# EasyEDA Pro project ProPrj_Inverted_MAML_6x6_2026-08-30.epro, schematic SUM35
Create Date: 2026-06-14; Page Name: P1; Project Name: Inverted_MAML_6x6; Schematic Name: Schematic1; Update Date: 2026-06-14; Company: EasyEDA.com; Drawn: Olle Welin; Page Size: A4; Version: V1.0
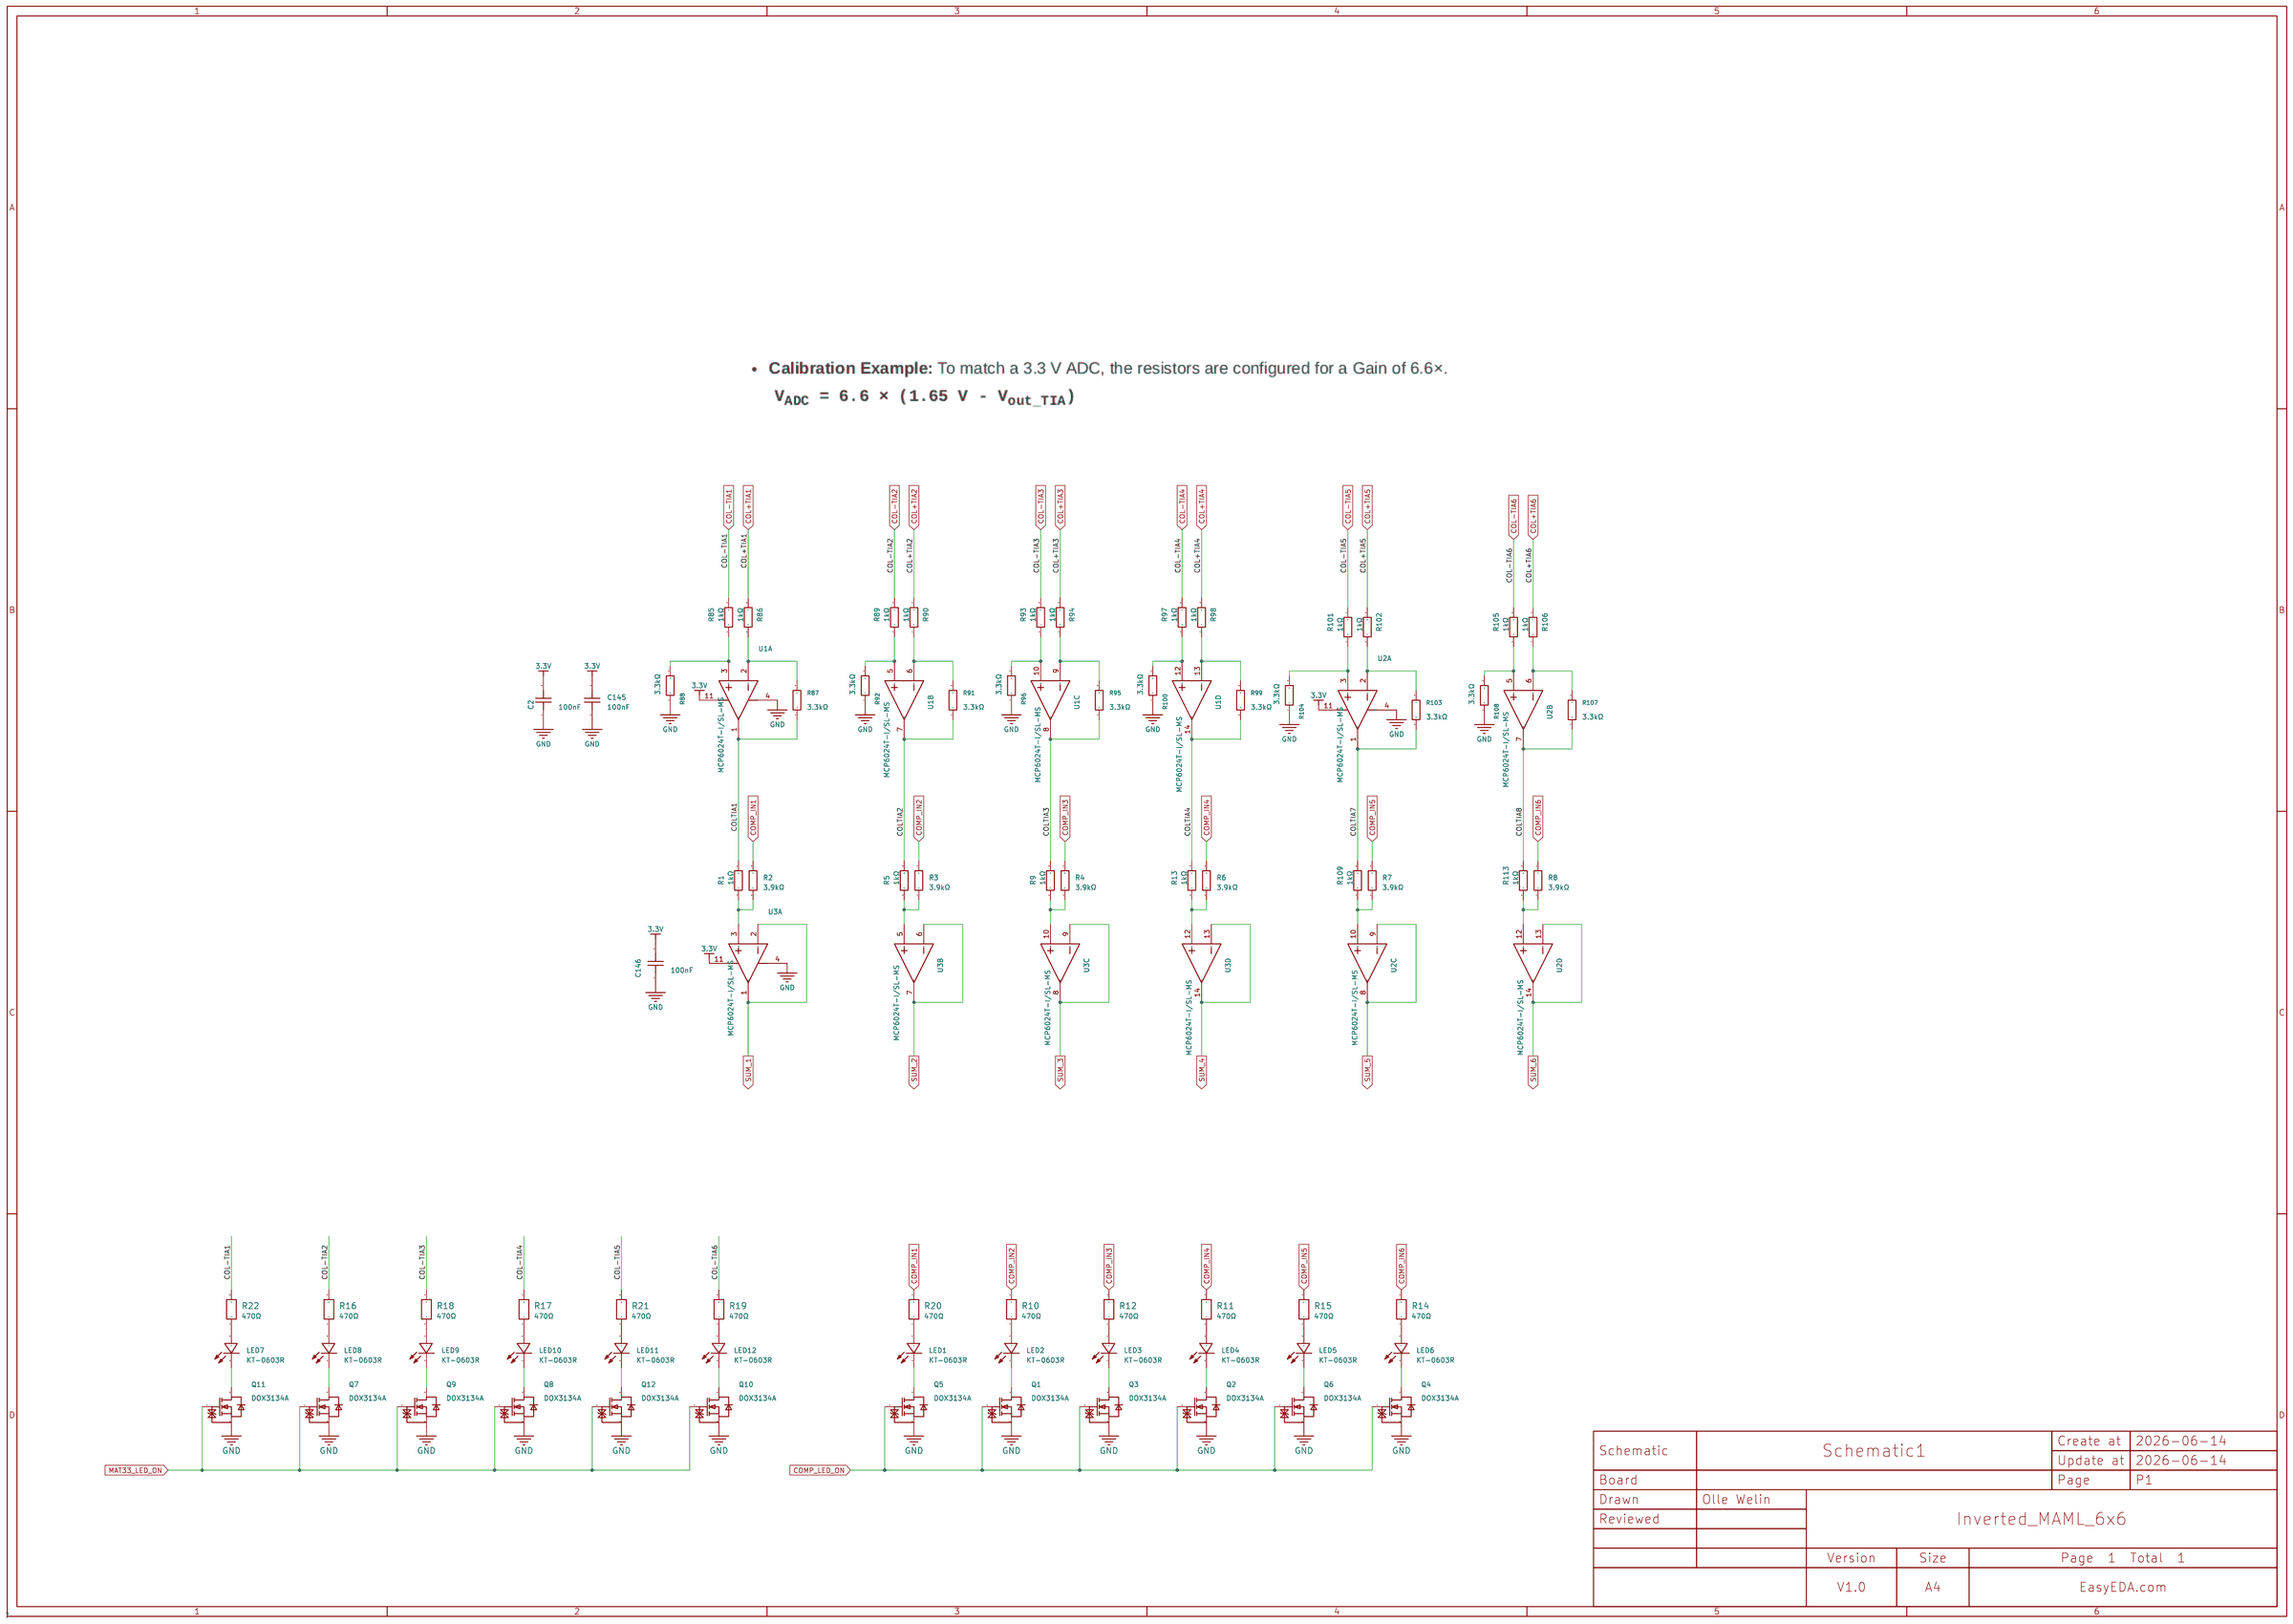
[diagram p6: schematic sheet]

## Parts
C2  100nF  [C0402]
C145  100nF  [C0402]
C146  100nF  [C0402]
LED1  KT-0603R  [LED0603-RD]
LED2  KT-0603R  [LED0603-RD]
LED3  KT-0603R  [LED0603-RD]
LED4  KT-0603R  [LED0603-RD]
LED5  KT-0603R  [LED0603-RD]
LED6  KT-0603R  [LED0603-RD]
LED7  KT-0603R  [LED0603-RD]
LED8  KT-0603R  [LED0603-RD]
LED9  KT-0603R  [LED0603-RD]
LED10  KT-0603R  [LED0603-RD]
LED11  KT-0603R  [LED0603-RD]
LED12  KT-0603R  [LED0603-RD]
Q1  DOX3134A  [SOT-323-3_L2.1-W1.3-P1.30-LS2.3-BR]
Q2  DOX3134A  [SOT-323-3_L2.1-W1.3-P1.30-LS2.3-BR]
Q3  DOX3134A  [SOT-323-3_L2.1-W1.3-P1.30-LS2.3-BR]
Q4  DOX3134A  [SOT-323-3_L2.1-W1.3-P1.30-LS2.3-BR]
Q5  DOX3134A  [SOT-323-3_L2.1-W1.3-P1.30-LS2.3-BR]
Q6  DOX3134A  [SOT-323-3_L2.1-W1.3-P1.30-LS2.3-BR]
Q7  DOX3134A  [SOT-323-3_L2.1-W1.3-P1.30-LS2.3-BR]
Q8  DOX3134A  [SOT-323-3_L2.1-W1.3-P1.30-LS2.3-BR]
Q9  DOX3134A  [SOT-323-3_L2.1-W1.3-P1.30-LS2.3-BR]
Q10  DOX3134A  [SOT-323-3_L2.1-W1.3-P1.30-LS2.3-BR]
Q11  DOX3134A  [SOT-323-3_L2.1-W1.3-P1.30-LS2.3-BR]
Q12  DOX3134A  [SOT-323-3_L2.1-W1.3-P1.30-LS2.3-BR]
R1  1kΩ  [R0402]
R2  3.9kΩ  [R0402]
R3  3.9kΩ  [R0402]
R4  3.9kΩ  [R0402]
R5  1kΩ  [R0402]
R6  3.9kΩ  [R0402]
R7  3.9kΩ  [R0402]
R8  3.9kΩ  [R0402]
R9  1kΩ  [R0402]
R10  470Ω  [R0402]
R11  470Ω  [R0402]
R12  470Ω  [R0402]
R13  1kΩ  [R0402]
R14  470Ω  [R0402]
R15  470Ω  [R0402]
R16  470Ω  [R0402]
R17  470Ω  [R0402]
R18  470Ω  [R0402]
R19  470Ω  [R0402]
R20  470Ω  [R0402]
R21  470Ω  [R0402]
R22  470Ω  [R0402]
R85  1kΩ  [R0402]
R86  1kΩ  [R0402]
R87  3.3kΩ  [R0402]
R88  3.3kΩ  [R0402]
R89  1kΩ  [R0402]
R90  1kΩ  [R0402]
R91  3.3kΩ  [R0402]
R92  3.3kΩ  [R0402]
R93  1kΩ  [R0402]
R94  1kΩ  [R0402]
R95  3.3kΩ  [R0402]
R96  3.3kΩ  [R0402]
R97  1kΩ  [R0402]
R98  1kΩ  [R0402]
R99  3.3kΩ  [R0402]
R100  3.3kΩ  [R0402]
R101  1kΩ  [R0402]
R102  1kΩ  [R0402]
R103  3.3kΩ  [R0402]
R104  3.3kΩ  [R0402]
R105  1kΩ  [R0402]
R106  1kΩ  [R0402]
R107  3.3kΩ  [R0402]
R108  3.3kΩ  [R0402]
R109  1kΩ  [R0402]
R113  1kΩ  [R0402]
U1  MCP6024T-I/SL-MS  [SOIC-14_L8.7-W3.9-P1.27-LS6.0-BL-1]  (sections 1,2,3,4)
U2  MCP6024T-I/SL-MS  [SOIC-14_L8.7-W3.9-P1.27-LS6.0-BL-1]  (sections 1,2,3,4)
U3  MCP6024T-I/SL-MS  [SOIC-14_L8.7-W3.9-P1.27-LS6.0-BL-1]  (sections 1,2,3,4)

## Library data of the parts
C2 C145 C146 = CL05B104KO5NNNC: Capacitance:100nF Tolerance:±10% Tolerance:±10% Voltage Rating:16V Temperature Coefficient:X7R; LCSC Part Name: 100nF ±10% 16V; Supplier Part: C1525; Manufacturer: SAMSUNG(三星); Supplier Footprint: 0402; JLCPCB Part Class: Basic Part; Datasheet: https://item.szlcsc.com/datasheet/CL05B104KO5NNNC/1877.html; Supplier: LCSC; Tolerance: ±10%; Voltage Rating: 16V; Temperature Coefficient: X7R
LED1-LED12 = KT-0603R: Emitted Color:Red Power Dissipation:- Forward Current:- Dominant Wavelength:- Dominant Wavelength:- Peak Wavelength:- Diode Configuration:- Lens Color:- Color Temperature:- Color Temperature:- Viewing Angle:- Mounting Sytle:- Operating Temperature:-40℃~+8; LCSC Part Name: 0603 红灯 高亮; Supplier Part: C2286; Manufacturer: KENTO; Supplier Footprint: 0603; JLCPCB Part Class: Basic Part; Datasheet: https://atta.szlcsc.com/upload/public/pdf/source/20160616/1466072038404.pdf; Supplier: LCSC; Emitted Color: Red; Operating Temperature: -40℃~+85℃
Q1-Q12 = DOX3134A: Number:1 N-channel Drain to Source Voltage:20V Current - Continuous Drain(Id):900mA RDS(on):120Ω@4.5V Pd - Power Dissipation:220mW Gate Threshold Voltage (Vgs(th)):600mV Gate Charge(Qg):1nC@4.5V Input Capacitance(Ciss):63pF Reverse Transfer Capacitance (C; Supplier Part: C54349756; Manufacturer: DOINGTER(杜因特); Supplier Footprint: SOT-323; JLCPCB Part Class: Extended Part; Datasheet: https://item.szlcsc.com/datasheet/DOX3134A/57652932.html; Supplier: LCSC; Number: 1 N-channel; Drain to Source Voltage: 20V; Current - Continuous Drain(Id): 900mA; RDS(on): 120Ω@4.5V; Pd - Power Dissipation: 220mW; Gate Threshold Voltage (Vgs(th)): 600mV; Gate Charge(Qg): 1nC@4.5V; Input Capacitance(Ciss): 63pF; Reverse Transfer Capacitance (Crss@Vds): 12pF; Operating Temperature: -50℃~+150℃; Type: N-Channel; Output Capacitance(Coss): 23pF
R1 R5 R9 R13 R85 R86 R89 R90 R93 R94 R97 R98 R101 R102 R105 R106 R109 R113 = 0402WGF1001TCE: Type:Thick Film Resistor Resistance:1kΩ Tolerance:±1% Tolerance:±1% Power(Watts):62.5mW Voltage-Supply(Max):50V Temperature Coefficient:±100ppm/℃ Temperature Coefficient:±100ppm/℃ Operating Temperature:-55℃~+155℃ Operating Temperature:-55℃~+155℃; LCSC Part Name: 1kΩ ±1% 62.5mW 厚膜电阻; Supplier Part: C11702; Manufacturer: UNI-ROYAL(厚声); Supplier Footprint: 0402; JLCPCB Part Class: Basic Part; Datasheet: https://item.szlcsc.com/datasheet/0402WGF1001TCE/12256.html; Supplier: LCSC; Type: Thick Film Resistor; Tolerance: ±1%; Power(Watts): 62.5mW; Voltage-Supply(Max): 50V; Temperature Coefficient: ±100ppm/℃; Operating Temperature: -55℃~+155℃
R2-R4 R6-R8 = 0402WGF3901TCE: Type:Thick Film Resistor Resistance:3.9kΩ Tolerance:±1% Tolerance:±1% Power(Watts):62.5mW Voltage-Supply(Max):50V Temperature Coefficient:±100ppm/℃ Temperature Coefficient:±100ppm/℃ Operating Temperature:-55℃~+155℃ Operating Temperature:-55℃~+155℃; LCSC Part Name: 3.9kΩ ±1% 62.5mW 厚膜电阻; Supplier Part: C51721; Manufacturer: UNI-ROYAL(厚声); Supplier Footprint: 0402; JLCPCB Part Class: Extended Part; Datasheet: https://item.szlcsc.com/datasheet/0402WGF3901TCE/52734.html; Supplier: LCSC; Type: Thick Film Resistor; Tolerance: ±1%; Power(Watts): 62.5mW; Voltage-Supply(Max): 50V; Temperature Coefficient: ±100ppm/℃; Operating Temperature: -55℃~+155℃
R10-R12 R14-R22 = 0402WGF4700TCE: Type:Thick Film Resistors Resistance: Tolerance:±1% Tolerance:±1% Power(Watts): Overload Voltage (Max): Temperature Coefficient:±100ppm/℃ Temperature Coefficient:±100ppm/℃ Operating Temperature Range:-55℃~+155℃ Operating Temperature Range:-55℃~+155℃; LCSC Part Name: 470Ω ±1% 62.5mW 厚膜电阻; Supplier Part: C25117; Manufacturer: UNI-ROYAL(厚声); Supplier Footprint: 0402; JLCPCB Part Class: Basic Part; Datasheet: https://atta.szlcsc.com/upload/public/pdf/source/20200306/C422600_1E6D84923E4A46A82E41ADD87F860B5C.pdf; Supplier: LCSC; Type: Thick Film Resistors; Tolerance: ±1%; Temperature Coefficient: ±100ppm/℃; Operating Temperature Range: -55℃~+155℃
R87 R88 R91 R92 R95 R96 R99 R100 R103 R104 R107 R108 = 0402WGF3301TCE: Type:Thick Film Resistor Resistance:3.3kΩ Tolerance:±1% Tolerance:±1% Power(Watts):62.5mW Voltage-Supply(Max):50V Temperature Coefficient:±100ppm/℃ Temperature Coefficient:±100ppm/℃ Operating Temperature:-55℃~+155℃ Operating Temperature:-55℃~+155℃; LCSC Part Name: 3.3kΩ ±1% 62.5mW 厚膜电阻; Supplier Part: C25890; Manufacturer: UNI-ROYAL(厚声); Supplier Footprint: 0402; JLCPCB Part Class: Basic Part; Datasheet: https://item.szlcsc.com/datasheet/0402WGF3301TCE/26633.html; Supplier: LCSC; Type: Thick Film Resistor; Tolerance: ±1%; Power(Watts): 62.5mW; Voltage-Supply(Max): 50V; Temperature Coefficient: ±100ppm/℃; Operating Temperature: -55℃~+155℃
U1-U3 = MCP6024T-I/SL-MS: Supplier Part: C54539958; Manufacturer: MSKSEMI(美森科); Supplier Footprint: SOP-14; JLCPCB Part Class: Extended Part; Datasheet: https://item.szlcsc.com/datasheet/MCP6024T-I%252FSL-MS/57895720.html; Supplier: LCSC

## Nets
3.3V: C2.2 C145.2 C146.2 U1.11(V-) U2.11(V-) U3.11(V-)
GND: C2.1 C145.1 C146.1 Q1.2(S) Q2.2(S) Q3.2(S) Q4.2(S) Q5.2(S) Q6.2(S) Q7.2(S) Q8.2(S) Q9.2(S) Q10.2(S) Q11.2(S) Q12.2(S) R88.1 R92.1 R96.1 R100.1 R104.1 R108.1 U1.4(V+) U2.4(V+) U3.4(V+)
COL+TIA1: R86.2
COL+TIA2: R90.2
COL+TIA3: R94.2
COL+TIA4: R98.2
COL+TIA5: R102.2
COL+TIA6: R106.2
COL-TIA1: R22.2 R85.2
COL-TIA2: R16.2 R89.2
COL-TIA3: R18.2 R93.2
COL-TIA4: R17.2 R97.2
COL-TIA5: R21.2 R101.2
COL-TIA6: R19.2 R105.2
COLTIA1: R1.2 R87.1 U1.1(OUT1)
COLTIA2: R5.2 R91.1 U1.7(OUT2)
COLTIA3: R9.2 R95.1 U1.8(OUT3)
COLTIA4: R13.2 R99.1 U1.14(OUT4)
COLTIA7: R103.1 R109.2 U2.1(OUT1)
COLTIA8: R107.1 R113.2 U2.7(OUT2)
COMP_IN1: R2.2 R20.2
COMP_IN2: R3.2 R10.2
COMP_IN3: R4.2 R12.2
COMP_IN4: R6.2 R11.2
COMP_IN5: R7.2 R15.2
COMP_IN6: R8.2 R14.2
COMP_LED_ON: Q1.1(G) Q2.1(G) Q3.1(G) Q4.1(G) Q5.1(G) Q6.1(G)
MAT33_LED_ON: Q7.1(G) Q8.1(G) Q9.1(G) Q10.1(G) Q11.1(G) Q12.1(G)
SUM_1: U3.1(OUT1) U3.2(IN1-)
SUM_2: U3.6(IN2-) U3.7(OUT2)
SUM_3: U3.8(OUT3) U3.9(IN3-)
SUM_4: U3.13(IN4-) U3.14(OUT4)
SUM_5: U2.8(OUT3) U2.9(IN3-)
SUM_6: U2.13(IN4-) U2.14(OUT4)
Net-(LED1-1): LED1.1(K) Q5.3(D)
Net-(LED1-2): LED1.2(A) R20.1
Net-(LED2-1): LED2.1(K) Q1.3(D)
Net-(LED2-2): LED2.2(A) R10.1
Net-(LED3-1): LED3.1(K) Q3.3(D)
Net-(LED3-2): LED3.2(A) R12.1
Net-(LED4-1): LED4.1(K) Q2.3(D)
Net-(LED4-2): LED4.2(A) R11.1
Net-(LED5-1): LED5.1(K) Q6.3(D)
Net-(LED5-2): LED5.2(A) R15.1
Net-(LED6-1): LED6.1(K) Q4.3(D)
Net-(LED6-2): LED6.2(A) R14.1
Net-(LED7-1): LED7.1(K) Q11.3(D)
Net-(LED7-2): LED7.2(A) R22.1
Net-(LED8-1): LED8.1(K) Q7.3(D)
Net-(LED8-2): LED8.2(A) R16.1
Net-(LED9-1): LED9.1(K) Q9.3(D)
Net-(LED9-2): LED9.2(A) R18.1
Net-(LED10-1): LED10.1(K) Q8.3(D)
Net-(LED10-2): LED10.2(A) R17.1
Net-(LED11-1): LED11.1(K) Q12.3(D)
Net-(LED11-2): LED11.2(A) R21.1
Net-(LED12-1): LED12.1(K) Q10.3(D)
Net-(LED12-2): LED12.2(A) R19.1
Net-(R1-1): R1.1 R2.1 U3.3(IN1+)
Net-(R3-1): R3.1 R5.1 U3.5(IN2+)
Net-(R4-1): R4.1 R9.1 U3.10(IN3+)
Net-(R6-1): R6.1 R13.1 U3.12(IN4+)
Net-(R7-1): R7.1 R109.1 U2.10(IN3+)
Net-(R8-1): R8.1 R113.1 U2.12(IN4+)
Net-(R85-1): R85.1 R88.2 U1.3(IN1+)
Net-(R86-1): R86.1 R87.2 U1.2(IN1-)
Net-(R89-1): R89.1 R92.2 U1.5(IN2+)
Net-(R90-1): R90.1 R91.2 U1.6(IN2-)
Net-(R93-1): R93.1 R96.2 U1.10(IN3+)
Net-(R94-1): R94.1 R95.2 U1.9(IN3-)
Net-(R97-1): R97.1 R100.2 U1.12(IN4+)
Net-(R98-1): R98.1 R99.2 U1.13(IN4-)
Net-(R101-1): R101.1 R104.2 U2.3(IN1+)
Net-(R102-1): R102.1 R103.2 U2.2(IN1-)
Net-(R105-1): R105.1 R108.2 U2.5(IN2+)
Net-(R106-1): R106.1 R107.2 U2.6(IN2-)
